# Altium project Jetson AGX Xavier Carrier Board.PrjPcb (part 4 of 8)

## Sheet JETSON AGX DP-HDMI-USB-GBE.SchDoc: Jetson AGX DP-HDMI-USB-GBE
size 431 x 279 mm; CheckedBy: Lance Bantoto; Engineer: Cindy Li, Chealsie Bains; DocumentNumber: 10; Revision: 1; SheetNumber: 10; SheetTotal: 23
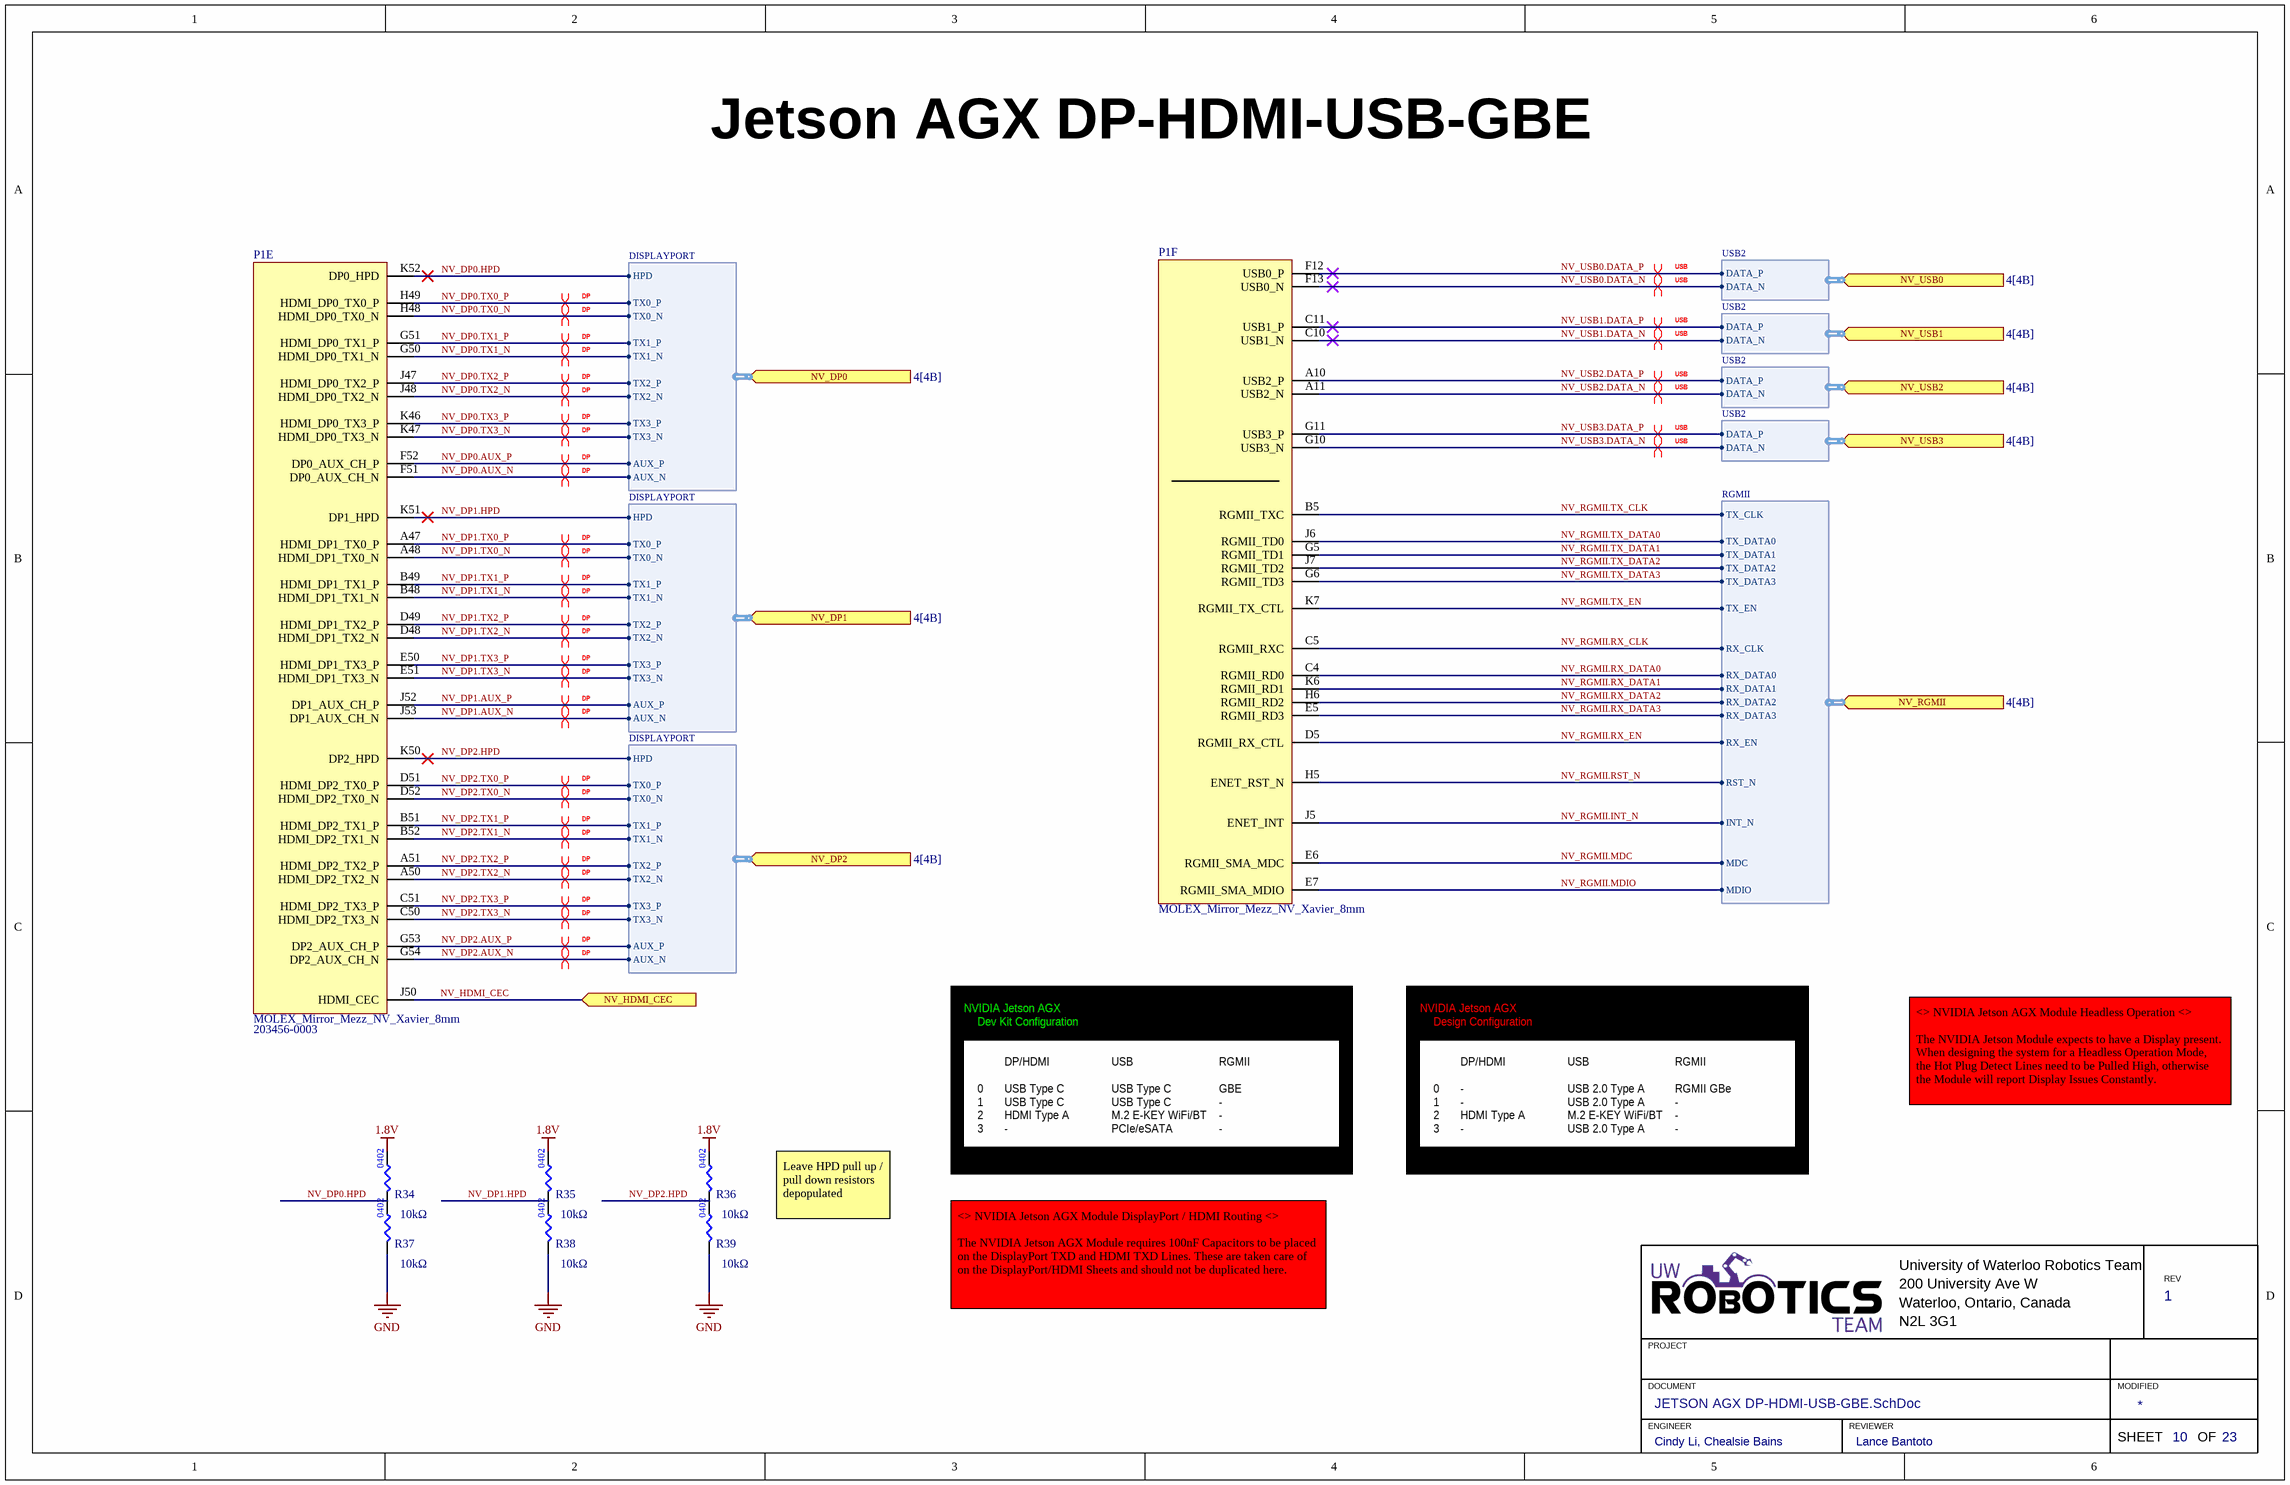
[diagram p13: JETSON AGX DP-HDMI-USB-GBE.SchDoc]

### Parts
P1  MOLEX_Mirror_Mezz_NV_Xavier_8mm  [203456-0003]  (parts E,F of 15)
R34  Resistance: 10kΩ  [RES0402]  (hidden comment: RES_10kΩ_0402_1%)
R35  Resistance: 10kΩ  [RES0402]  (hidden comment: RES_10kΩ_0402_1%)
R36  Resistance: 10kΩ  [RES0402]  (hidden comment: RES_10kΩ_0402_1%)
R37  Resistance: 10kΩ  [RES0402]  (hidden comment: RES_10kΩ_0402_1%)
R38  Resistance: 10kΩ  [RES0402]  (hidden comment: RES_10kΩ_0402_1%)
R39  Resistance: 10kΩ  [RES0402]  (hidden comment: RES_10kΩ_0402_1%)

### Ports
NV_DP0 (in, harness DISPLAYPORT, see 4[4B]), NV_DP1 (in, harness DISPLAYPORT, see 4[4B]), NV_DP2 (in, harness DISPLAYPORT, see 4[4B]), NV_HDMI_CEC (in), NV_RGMII (in, harness RGMII, see 4[4B]), NV_USB0 (in, harness USB2, see 4[4B]), NV_USB1 (in, harness USB2, see 4[4B]), NV_USB2 (in, harness USB2, see 4[4B]), NV_USB3 (in, harness USB2, see 4[4B])

### Harnesses
DISPLAYPORT: HPD, TX0_P, TX0_N, TX1_P, TX1_N, TX2_P, TX2_N, TX3_P, TX3_N, AUX_P, AUX_N
USB2: DATA_P, DATA_N
RGMII: RX_EN, RX_CLK, RX_DATA0, RX_DATA1, RX_DATA2, RX_DATA3, TX_DATA3, TX_DATA2, TX_DATA1, TX_DATA0, TX_EN, TX_CLK, MDIO, MDC, INT_N, RST_N

### Nets
1.8V: R34.2 R35.2 R36.2
GND: R37.1 R38.1 R39.1
NV_DP0.AUX_N: P1.F51(DP0_AUX_CH_N) ; port NV_DP0.AUX_N
NV_DP0.AUX_P: P1.F52(DP0_AUX_CH_P) ; port NV_DP0.AUX_P
NV_DP0.HPD: P1.K52(DP0_HPD) R37.2 ; port NV_DP0.HPD
NV_DP0.TX0_N: P1.H48(HDMI_DP0_TX0_N) ; port NV_DP0.TX0_N
NV_DP0.TX0_P: P1.H49(HDMI_DP0_TX0_P) ; port NV_DP0.TX0_P
NV_DP0.TX1_N: P1.G50(HDMI_DP0_TX1_N) ; port NV_DP0.TX1_N
NV_DP0.TX1_P: P1.G51(HDMI_DP0_TX1_P) ; port NV_DP0.TX1_P
NV_DP0.TX2_N: P1.J48(HDMI_DP0_TX2_N) ; port NV_DP0.TX2_N
NV_DP0.TX2_P: P1.J47(HDMI_DP0_TX2_P) ; port NV_DP0.TX2_P
NV_DP0.TX3_N: P1.K47(HDMI_DP0_TX3_N) ; port NV_DP0.TX3_N
NV_DP0.TX3_P: P1.K46(HDMI_DP0_TX3_P) ; port NV_DP0.TX3_P
NV_DP1.AUX_N: P1.J53(DP1_AUX_CH_N) ; port NV_DP1.AUX_N
NV_DP1.AUX_P: P1.J52(DP1_AUX_CH_P) ; port NV_DP1.AUX_P
NV_DP1.HPD: P1.K51(DP1_HPD) R38.2 ; port NV_DP1.HPD
NV_DP1.TX0_N: P1.A48(HDMI_DP1_TX0_N) ; port NV_DP1.TX0_N
NV_DP1.TX0_P: P1.A47(HDMI_DP1_TX0_P) ; port NV_DP1.TX0_P
NV_DP1.TX1_N: P1.B48(HDMI_DP1_TX1_N) ; port NV_DP1.TX1_N
NV_DP1.TX1_P: P1.B49(HDMI_DP1_TX1_P) ; port NV_DP1.TX1_P
NV_DP1.TX2_N: P1.D48(HDMI_DP1_TX2_N) ; port NV_DP1.TX2_N
NV_DP1.TX2_P: P1.D49(HDMI_DP1_TX2_P) ; port NV_DP1.TX2_P
NV_DP1.TX3_N: P1.E51(HDMI_DP1_TX3_N) ; port NV_DP1.TX3_N
NV_DP1.TX3_P: P1.E50(HDMI_DP1_TX3_P) ; port NV_DP1.TX3_P
NV_DP2.AUX_N: P1.G54(DP2_AUX_CH_N) ; port NV_DP2.AUX_N
NV_DP2.AUX_P: P1.G53(DP2_AUX_CH_P) ; port NV_DP2.AUX_P
NV_DP2.HPD: P1.K50(DP2_HPD) R39.2 ; port NV_DP2.HPD
NV_DP2.TX0_N: P1.D52(HDMI_DP2_TX0_N) ; port NV_DP2.TX0_N
NV_DP2.TX0_P: P1.D51(HDMI_DP2_TX0_P) ; port NV_DP2.TX0_P
NV_DP2.TX1_N: P1.B52(HDMI_DP2_TX1_N) ; port NV_DP2.TX1_N
NV_DP2.TX1_P: P1.B51(HDMI_DP2_TX1_P) ; port NV_DP2.TX1_P
NV_DP2.TX2_N: P1.A50(HDMI_DP2_TX2_N) ; port NV_DP2.TX2_N
NV_DP2.TX2_P: P1.A51(HDMI_DP2_TX2_P) ; port NV_DP2.TX2_P
NV_DP2.TX3_N: P1.C50(HDMI_DP2_TX3_N) ; port NV_DP2.TX3_N
NV_DP2.TX3_P: P1.C51(HDMI_DP2_TX3_P) ; port NV_DP2.TX3_P
NV_HDMI_CEC: P1.J50(HDMI_CEC) ; port NV_HDMI_CEC
NV_RGMII.INT_N: P1.J5(ENET_INT) ; port NV_RGMII.INT_N
NV_RGMII.MDC: P1.E6(RGMII_SMA_MDC) ; port NV_RGMII.MDC
NV_RGMII.MDIO: P1.E7(RGMII_SMA_MDIO) ; port NV_RGMII.MDIO
NV_RGMII.RST_N: P1.H5(ENET_RST_N) ; port NV_RGMII.RST_N
NV_RGMII.RX_CLK: P1.C5(RGMII_RXC) ; port NV_RGMII.RX_CLK
NV_RGMII.RX_DATA0: P1.C4(RGMII_RD0) ; port NV_RGMII.RX_DATA0
NV_RGMII.RX_DATA1: P1.K6(RGMII_RD1) ; port NV_RGMII.RX_DATA1
NV_RGMII.RX_DATA2: P1.H6(RGMII_RD2) ; port NV_RGMII.RX_DATA2
NV_RGMII.RX_DATA3: P1.E5(RGMII_RD3) ; port NV_RGMII.RX_DATA3
NV_RGMII.RX_EN: P1.D5(RGMII_RX_CTL) ; port NV_RGMII.RX_EN
NV_RGMII.TX_CLK: P1.B5(RGMII_TXC) ; port NV_RGMII.TX_CLK
NV_RGMII.TX_DATA0: P1.J6(RGMII_TD0) ; port NV_RGMII.TX_DATA0
NV_RGMII.TX_DATA1: P1.G5(RGMII_TD1) ; port NV_RGMII.TX_DATA1
NV_RGMII.TX_DATA2: P1.J7(RGMII_TD2) ; port NV_RGMII.TX_DATA2
NV_RGMII.TX_DATA3: P1.G6(RGMII_TD3) ; port NV_RGMII.TX_DATA3
NV_RGMII.TX_EN: P1.K7(RGMII_TX_CTL) ; port NV_RGMII.TX_EN
NV_USB0.DATA_N: P1.F13(USB0_N) ; port NV_USB0.DATA_N
NV_USB0.DATA_P: P1.F12(USB0_P) ; port NV_USB0.DATA_P
NV_USB1.DATA_N: P1.C10(USB1_N) ; port NV_USB1.DATA_N
NV_USB1.DATA_P: P1.C11(USB1_P) ; port NV_USB1.DATA_P
NV_USB2.DATA_N: P1.A11(USB2_N) ; port NV_USB2.DATA_N
NV_USB2.DATA_P: P1.A10(USB2_P) ; port NV_USB2.DATA_P
NV_USB3.DATA_N: P1.G10(USB3_N) ; port NV_USB3.DATA_N
NV_USB3.DATA_P: P1.G11(USB3_P) ; port NV_USB3.DATA_P

Not connected (* = marked no-connect by the designer): R34 1; R35 1; R36 1

### Layout directives
differential pair; differential pair class NV_DISPLAY; differential pair class NV_DP0; differential pair class DP: NV_DP0.AUX_N, NV_DP0.AUX_P, NV_DP0.TX0_N, NV_DP0.TX0_P, NV_DP0.TX1_N, NV_DP0.TX1_P, NV_DP0.TX2_N, NV_DP0.TX2_P, NV_DP0.TX3_N, NV_DP0.TX3_P
differential pair; differential pair class NV_DISPLAY; differential pair class NV_DP1; differential pair class DP: NV_DP1.AUX_N, NV_DP1.AUX_P, NV_DP1.TX0_N, NV_DP1.TX0_P, NV_DP1.TX1_N, NV_DP1.TX1_P, NV_DP1.TX2_N, NV_DP1.TX2_P, NV_DP1.TX3_N, NV_DP1.TX3_P
differential pair; differential pair class NV_DISPLAY; differential pair class NV_DP2; differential pair class DP: NV_DP2.AUX_N, NV_DP2.AUX_P, NV_DP2.TX0_N, NV_DP2.TX0_P, NV_DP2.TX1_N, NV_DP2.TX1_P, NV_DP2.TX2_N, NV_DP2.TX2_P, NV_DP2.TX3_N, NV_DP2.TX3_P
differential pair; differential pair class NV_USB; differential pair class NV_USB0; differential pair class USB: NV_USB0.DATA_N, NV_USB0.DATA_P
differential pair; differential pair class NV_USB; differential pair class NV_USB1; differential pair class USB: NV_USB1.DATA_N, NV_USB1.DATA_P
differential pair; differential pair class NV_USB; differential pair class NV_USB2; differential pair class USB: NV_USB2.DATA_N, NV_USB2.DATA_P
differential pair; differential pair class NV_USB; differential pair class NV_USB3; differential pair class USB: NV_USB3.DATA_N, NV_USB3.DATA_P

### Notes on the sheet
- NVIDIA Jetson AGX
- Dev Kit Configuration
- Design Configuration
- DP/HDMI
- USB
- RGMII
- <> NVIDIA Jetson AGX Module Headless Operation <>
  The NVIDIA Jetson Module expects to have a Display present. When designing the system for a Headless Operation Mode, the Hot Plug Detect Lines need to be Pulled High, otherwise the Module will report Display Issues Constantly.
- 0
  1
  2
  3
  4
  5
  6
  7
  8
  9
  10
  11
- USB Type C
  USB Type C
  HDMI Type A
  -
- USB Type C
  USB Type C
  M.2 E-KEY WiFi/BT
  PCIe/eSATA
- GBE
  -
  -
  -
- -
  -
  HDMI Type A
  -
- USB 2.0 Type A
  USB 2.0 Type A
  M.2 E-KEY WiFi/BT
  USB 2.0 Type A
- RGMII GBe
  -
  -
  -
- Leave HPD pull up / pull down resistors depopulated
- <> NVIDIA Jetson AGX Module DisplayPort / HDMI Routing <>
  The NVIDIA Jetson AGX Module requires 100nF Capacitors to be placed on the DisplayPort TXD and HDMI TXD Lines. These are taken care of on the DisplayPort/HDMI Sheets and should not be duplicated here.
- University of Waterloo Robotics Team
- 200 University Ave W
- REV
- PROJECT
- Waterloo, Ontario, Canada
- N2L 3G1
- DOCUMENT
- ENGINEER
- REVIEWER
- MODIFIED
- SHEET
- OF

### Library data of the parts
P1 = MOLEX_Mirror_Mezz_NV_Xavier_8mm: as P1 on sheet JETSON AGX CSI-I2C-I2S; Supplier 1: Digi-Key; Supplier Part Number 1: WM25528CT-ND; Manufacturer Part Number 1: 203456-0003
R34-R39 = RES_10kΩ_0402_1%: as R132 on sheet M.2 E-KEY; Supplier 1: Digi-Key; Supplier Part Number 1: 1276-3431-1-ND; Tolerance: 1%; Package: 0402